# EAGLE schematic garden_drill (EAGLE 9.0.0)
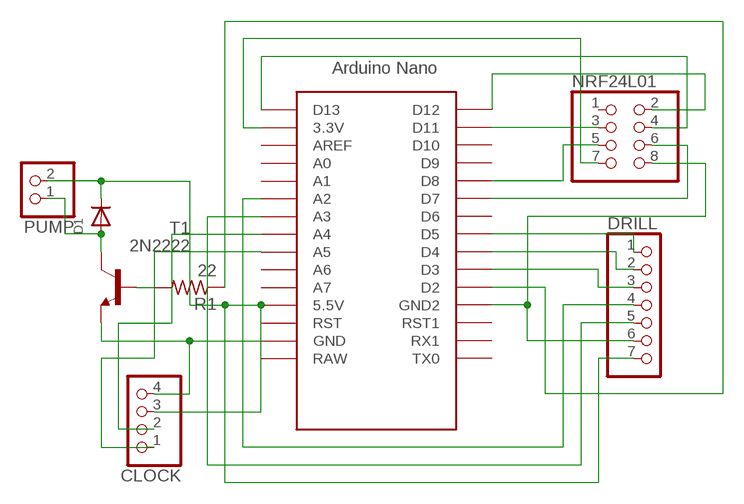
[diagram p0: schematic, sheet 1]

## Parts
CLOCK  PINHD-1X4  [1X04]
D1  DIODEDO-1N4148  [DO-1N4148]
DRILL  PINHD-1X7  [1X07]
NRF24L01  PINHD-2X4_2.54  [2X04]
PUMP  PINHD-1X2  [1X02]
R1  22  R-US_0204/7  [0204/7]
T1  2N2222  [TO92-EBC-OVAL]
U$1  NANO  [NANO]

## Nets
N$1: NRF24L01.4 U$1.D13
N$2: NRF24L01.2 U$1.D12
N$3: NRF24L01.3 U$1.D11
N$4: NRF24L01.5 U$1.D8
N$5: NRF24L01.6 U$1.D7
N$6: NRF24L01.7 U$1.3.3V
N$7: DRILL.2 U$1.D4
N$8: DRILL.6 NRF24L01.8 U$1.GND1(GND2)
N$9: R1.2 T1.B
N$10: DRILL.4 U$1.A2
N$11: R1.1 U$1.D2
N$12: CLOCK.4 T1.E U$1.GND
N$13: DRILL.1 U$1.D5
N$14: DRILL.5 U$1.A3
N$15: DRILL.3 U$1.D3
N$16: CLOCK.3 D1.C DRILL.7 PUMP.2 U$1.5V(5.5V)
N$17: D1.A PUMP.1 T1.C
N$18: CLOCK.2 U$1.A4
N$19: CLOCK.1 U$1.A5
Unconnected: NRF24L01.1 U$1.A0 U$1.A1 U$1.A6 U$1.A7 U$1.AREF U$1.D6 U$1.D9 U$1.D10 U$1.ICSP1 U$1.ICSP2 U$1.ICSP3 U$1.ICSP4 U$1.ICSP5 U$1.ICSP6 U$1.RAW U$1.RST U$1.RST1 U$1.RX1 U$1.TX0

## Library data of the parts
CLOCK = pinhead:PINHD-1X4: PIN HEADER
D1 = adafruit:DIODE: Diode SMADIODE - SMA Surface Mount Package 20V 1A Schottky Diode Digikey: 641-1014-6-ND DO-1N4148 - Through Hole Small Current Diode SOD-123 20V 1 A (.5mV Vf) Schottky Diode - Digikey: MBRX120TPMSCT-ND SOD-323 10V 570mA (.38mV Vf, 3ns) Schottky Diode - Digikey: ZLLS410CT-ND SOD-523 30V 30mA Schottky Diode (RB751S-40TE61) - Digikey: RB751S-40TE61CT-ND SOT23-R/W - SOT23 Package (R = Solder Paste/Reflow Ovens, W = Hand-Soldering) BAT54Film 40V 300mA - Digikey: 497-7162-1-ND
DRILL = pinhead:PINHD-1X7: PIN HEADER
NRF24L01 = pinhead-1:PINHD-2X4: PIN HEADER
PUMP = pinhead:PINHD-1X2: PIN HEADER
R1 = adafruit:R-US_: RESISTOR, American symbol
T1 = adafruit:2N2222: NPN TRANSISTOR Big oval pads
U$1 = Arduino-clone:NANO: Arduino Nano

## Net classes
0 default: width 0.203 mm